# Altium schematic sheet m-2.SchDoc
size 420 x 297 mm
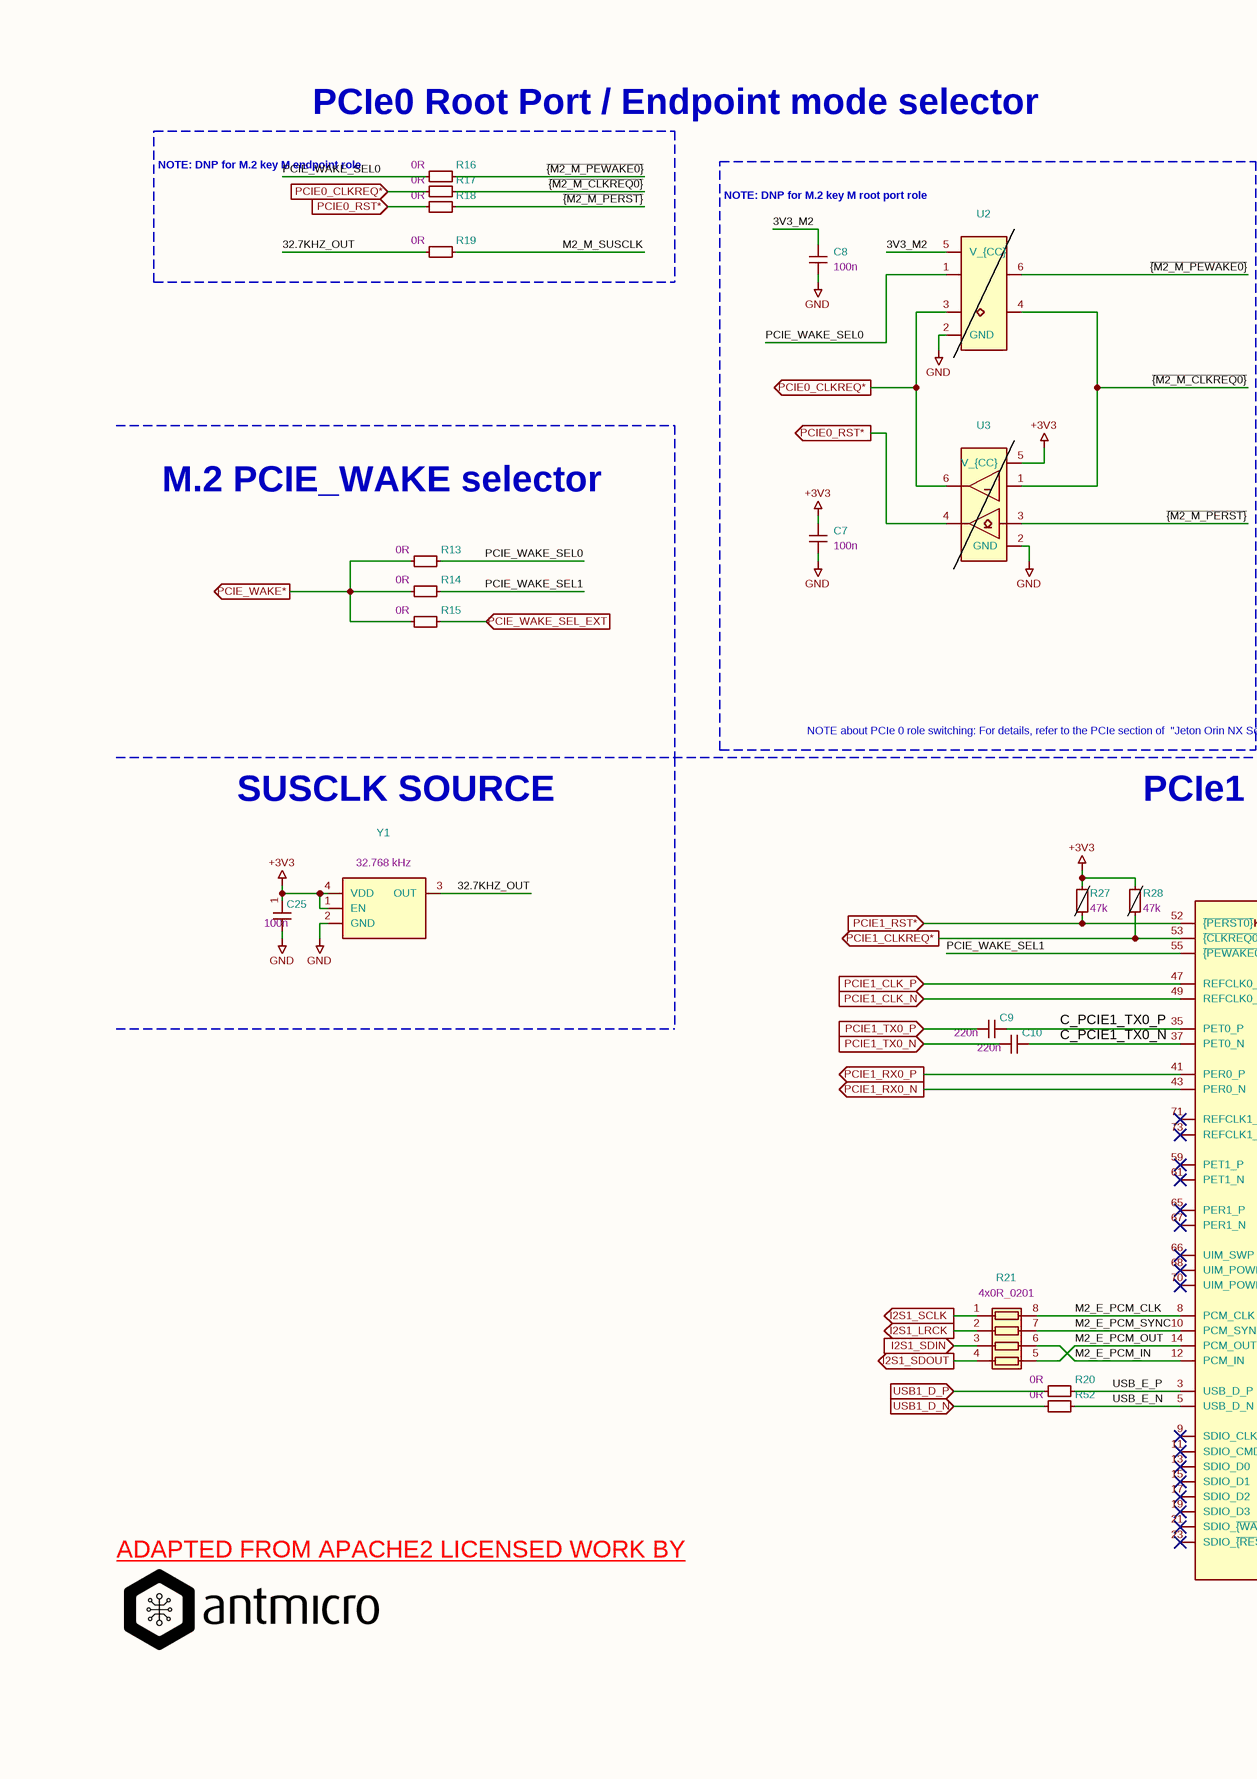
[diagram p0: m-2.SchDoc, left]
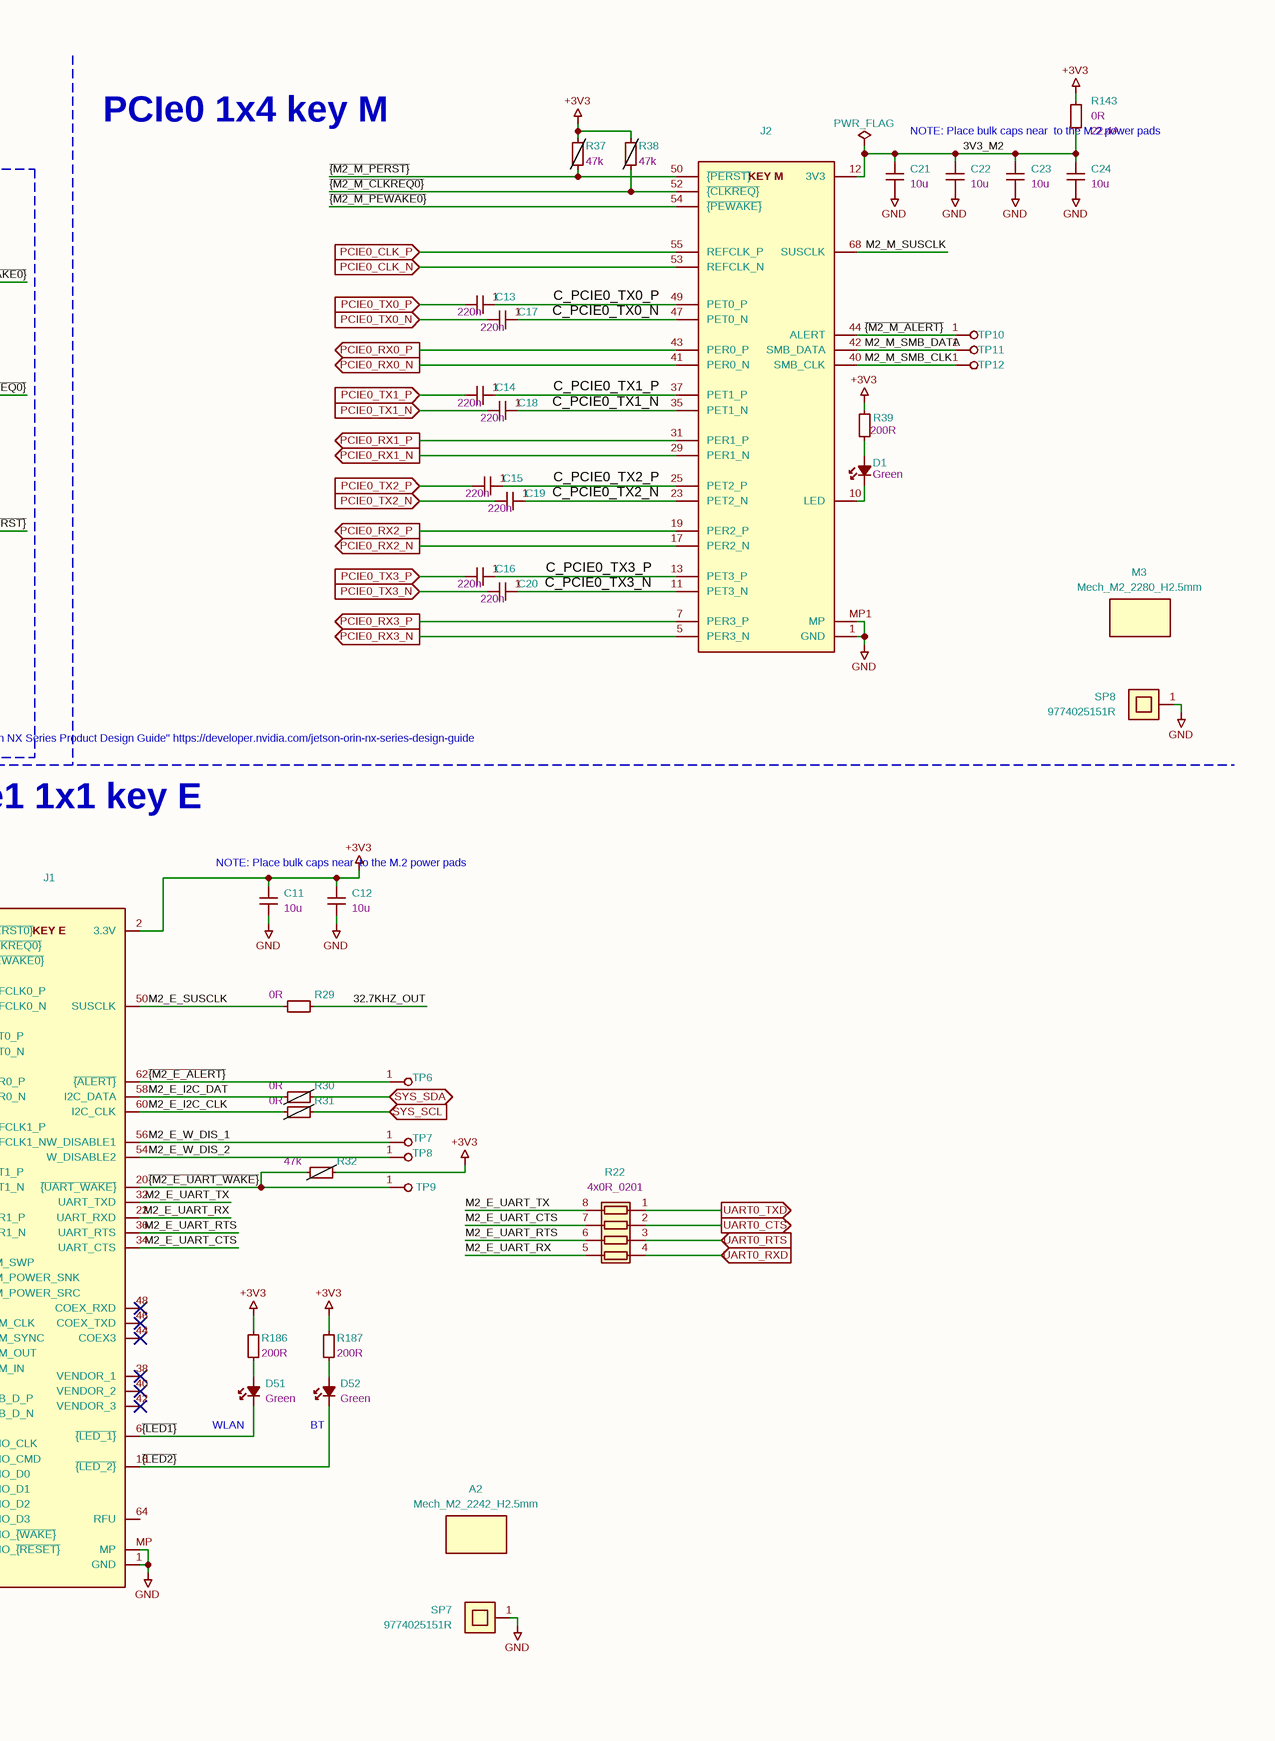
[diagram p1: m-2.SchDoc, right]

## Parts
#FLG02  PWR_FLAG  (graphical)
A2  Mech_M2_2242_H2.5mm  [Mech_M2_2242_H2.5mm]
C7  Val: 100n  [C_0402_1005Metric]  (hidden comment: GRM155R61H104KE14D)
C8  Val: 100n  [C_0402_1005Metric]  (hidden comment: GRM155R61H104KE14D)
C9  Val: 220n  [C_0402_1005Metric]  (hidden comment: CC0402KRX5R6BB224)
C10  Val: 220n  [C_0402_1005Metric]  (hidden comment: CC0402KRX5R6BB224)
C11  Val: 10u  [C_0603_1608Metric]  (hidden comment: GRM188R61A106KE69D)
C12  Val: 10u  [C_0603_1608Metric]  (hidden comment: GRM188R61A106KE69D)
C13  Val: 220n  [C_0402_1005Metric]  (hidden comment: CC0402KRX5R6BB224)
C14  Val: 220n  [C_0402_1005Metric]  (hidden comment: CC0402KRX5R6BB224)
C15  Val: 220n  [C_0402_1005Metric]  (hidden comment: CC0402KRX5R6BB224)
C16  Val: 220n  [C_0402_1005Metric]  (hidden comment: CC0402KRX5R6BB224)
C17  Val: 220n  [C_0402_1005Metric]  (hidden comment: CC0402KRX5R6BB224)
C18  Val: 220n  [C_0402_1005Metric]  (hidden comment: CC0402KRX5R6BB224)
C19  Val: 220n  [C_0402_1005Metric]  (hidden comment: CC0402KRX5R6BB224)
C20  Val: 220n  [C_0402_1005Metric]  (hidden comment: CC0402KRX5R6BB224)
C21  Val: 10u  [C_0603_1608Metric]  (hidden comment: GRM188R61A106KE69D)
C22  Val: 10u  [C_0603_1608Metric]  (hidden comment: GRM188R61A106KE69D)
C23  Val: 10u  [C_0603_1608Metric]  (hidden comment: GRM188R61A106KE69D)
C24  Val: 10u  [C_0603_1608Metric]  (hidden comment: GRM188R61A106KE69D)
C25  Val: 100n  [C_0402_1005Metric]  (hidden comment: GRM155R61H104KE14D)
D1  Color: Green  [LED_0603_1608Metric_G]  (hidden comment: LTST-C190GKT)
D51  Color: Green  [LED_0603_1608Metric_G]  (hidden comment: LTST-C190GKT)
D52  Color: Green  [LED_0603_1608Metric_G]  (hidden comment: LTST-C190GKT)
J1  2199230-6  [Bus_M.2_Socket_Key_E_TE_2199230-6]  (value not drawn)
J2  1-2199230-6  [Bus_M.2_Socket_Key_M_TE_1-2199230-6]  (value not drawn)
M3  Mech_M2_2280_H2.5mm  [Mech_M2_2280_H2.5mm]  (mechanical)
R13  Val: 0R  [R_0402_1005Metric]  (hidden comment: ERJ2GE0R00X)
R14  Val: 0R  [R_0402_1005Metric]  (hidden comment: ERJ2GE0R00X)
R15  Val: 0R  [R_0402_1005Metric]  (hidden comment: ERJ2GE0R00X)
R16  Val: 0R  [R_0402_1005Metric]  (hidden comment: ERJ2GE0R00X)
R17  Val: 0R  [R_0402_1005Metric]  (hidden comment: ERJ2GE0R00X)
R18  Val: 0R  [R_0402_1005Metric]  (hidden comment: ERJ2GE0R00X)
R19  Val: 0R  [R_0402_1005Metric]  (hidden comment: ERJ2GE0R00X)
R20  Val: 0R  [R_0402_1005Metric]  (hidden comment: ERJ2GE0R00X)
R21  Val: 4x0R_0201  [R_Array_4x0201_Panasonic_EXB18V]  (hidden comment: EXB-18VR000X)
R22  Val: 4x0R_0201  [R_Array_4x0201_Panasonic_EXB18V]  (hidden comment: EXB-18VR000X)
R27  Val: 47k  [R_0402_1005Metric]  (hidden comment: CR0402-FX-4702GLF)  (no BOM)
R28  Val: 47k  [R_0402_1005Metric]  (hidden comment: CR0402-FX-4702GLF)  (no BOM)
R29  Val: 0R  [R_0402_1005Metric]  (hidden comment: ERJ2GE0R00X)
R30  Val: 0R  [R_0402_1005Metric]  (hidden comment: ERJ2GE0R00X)  (no BOM)
R31  Val: 0R  [R_0402_1005Metric]  (hidden comment: ERJ2GE0R00X)  (no BOM)
R32  Val: 47k  [R_0402_1005Metric]  (hidden comment: CR0402-FX-4702GLF)  (no BOM)
R37  Val: 47k  [R_0402_1005Metric]  (hidden comment: CR0402-FX-4702GLF)  (no BOM)
R38  Val: 47k  [R_0402_1005Metric]  (hidden comment: CR0402-FX-4702GLF)  (no BOM)
R39  Val: 200R  [R_0402_1005Metric]  (hidden comment: CR0402-FX-2000GLF)
R52  Val: 0R  [R_0402_1005Metric]  (hidden comment: ERJ2GE0R00X)
R143  Val: 0R  Max. Curr.: 22.4A  [R_0603_1608Metric]  (hidden comment: PMR03EZPJ000)
R186  Val: 200R  [R_0402_1005Metric]  (hidden comment: CR0402-FX-2000GLF)
R187  Val: 200R  [R_0402_1005Metric]  (hidden comment: CR0402-FX-2000GLF)
SP7  9774025151R  [Spacer_Drill3.7mm_H2.5mm_9774025151R]
SP8  9774025151R  [Spacer_Drill3.7mm_H2.5mm_9774025151R]
TP6  TP_0.75mm_SMD  [TP_SMD_0.75mm]  (value not drawn)  (no BOM)
TP7  TP_0.75mm_SMD  [TP_SMD_0.75mm]  (value not drawn)  (no BOM)
TP8  TP_0.75mm_SMD  [TP_SMD_0.75mm]  (value not drawn)  (no BOM)
TP9  TP_0.75mm_SMD  [TP_SMD_0.75mm]  (value not drawn)  (no BOM)
TP10  TP_0.75mm_SMD  [TP_SMD_0.75mm]  (value not drawn)  (no BOM)
TP11  TP_0.75mm_SMD  [TP_SMD_0.75mm]  (value not drawn)  (no BOM)
TP12  TP_0.75mm_SMD  [TP_SMD_0.75mm]  (value not drawn)  (no BOM)
U2  74LVC2G07GV,125  [SC-74-6_1.5x2.9mm_P0.95mm]  (value not drawn)  (no BOM)
U3  74LVC2G07GV,125  [SC-74-6_1.5x2.9mm_P0.95mm]  (value not drawn)  (no BOM)
Y1  Val: 32.768 kHz  [Oscillator_SMD_ECS_2520MV_2.5x2mm]  (hidden comment: ECS-327MVATX-2-CN-TR3)

## Blocks framed on the sheet
PCIe0 Root Port / Endpoint mode selector: R16-R19
NOTE: / DNP for M.2 key M / root port role: C7 C8 U2 U3

## Ports
I2S1_LRCK (out), I2S1_SCLK (out), I2S1_SDIN (in), I2S1_SDOUT (out), PCIE0_CLK_N (in), PCIE0_CLK_P (in), PCIE0_CLKREQ* (in), PCIE0_CLKREQ* (out), PCIE0_RST* (in), PCIE0_RST* (out), PCIE0_RX0_N (out), PCIE0_RX0_P (out), PCIE0_RX1_N (out), PCIE0_RX1_P (out), PCIE0_RX2_N (out), PCIE0_RX2_P (out), PCIE0_RX3_N (out), PCIE0_RX3_P (out), PCIE0_TX0_N (in), PCIE0_TX0_P (in), PCIE0_TX1_N (in), PCIE0_TX1_P (in), PCIE0_TX2_N (in), PCIE0_TX2_P (in), PCIE0_TX3_N (in), PCIE0_TX3_P (in), PCIE1_CLK_N (in), PCIE1_CLK_P (in), PCIE1_CLKREQ* (out), PCIE1_RST* (in), PCIE1_RX0_N (out), PCIE1_RX0_P (out), PCIE1_TX0_N (in), PCIE1_TX0_P (in), PCIE_WAKE* (out), PCIE_WAKE_SEL_EXT (in), SYS_SCL (in), SYS_SDA (bidir), UART0_CTS (out), UART0_RTS (in), UART0_RXD (in), UART0_TXD (out), USB1_D_N (in), USB1_D_P (in)

## Nets
+3V3: C7.1 C11.1 C12.1 C25.1 J1.2(3.3V) R27.1 R28.1 R32.2 R37.1 R38.1 R39.2 R143.2 R186.2 R187.2 U3.5(V_{CC}) Y1.1(EN) Y1.4(VDD)
GND: C7.2 C8.2 C11.2 C12.2 C21.2 C22.2 C23.2 C24.2 C25.2 J1.1(GND) J1.MP J2.1(GND) J2.MP1(MP) SP7.1 SP8.1 U2.2(GND) U3.2(GND) Y1.2(GND)
3V3_M2: #FLG02.1(pwr) C8.1 C21.1 C22.1 C23.1 C24.1 J2.12(3V3) R143.1 U2.5(V_{CC})
32.7KHZ_OUT: R19.1 R29.2 Y1.3(OUT)
C_PCIE0_TX0_N: C17.1 J2.47(PET0_N)
C_PCIE0_TX0_P: C13.1 J2.49(PET0_P)
C_PCIE0_TX1_N: C18.1 J2.35(PET1_N)
C_PCIE0_TX1_P: C14.1 J2.37(PET1_P)
C_PCIE0_TX2_N: C19.1 J2.23(PET2_N)
C_PCIE0_TX2_P: C15.1 J2.25(PET2_P)
C_PCIE0_TX3_N: C20.1 J2.11(PET3_N)
C_PCIE0_TX3_P: C16.1 J2.13(PET3_P)
C_PCIE1_TX0_N: C10.2 J1.37(PET0_N)
C_PCIE1_TX0_P: C9.2 J1.35(PET0_P)
I2S1_LRCK: R21.2(R2.1) ; port I2S1_LRCK
I2S1_SCLK: R21.1(R1.1) ; port I2S1_SCLK
I2S1_SDIN: R21.3(R3.1) ; port I2S1_SDIN
I2S1_SDOUT: R21.4(R4.1) ; port I2S1_SDOUT
M2_E_I2C_CLK: J1.60(I2C_CLK) R31.1
M2_E_I2C_DAT: J1.58(I2C_DATA) R30.1
M2_E_PCM_CLK: J1.8(PCM_CLK) R21.8(R1.2)
M2_E_PCM_IN: J1.12(PCM_IN) R21.6(R3.2)
M2_E_PCM_OUT: J1.14(PCM_OUT) R21.5(R4.2)
M2_E_PCM_SYNC: J1.10(PCM_SYNC) R21.7(R2.2)
M2_E_SUSCLK: J1.50(SUSCLK) R29.1
M2_E_UART_CTS: J1.34(UART_CTS) R22.7(R2.2)
M2_E_UART_RTS: J1.36(UART_RTS) R22.6(R3.2)
M2_E_UART_RX: J1.22(UART_RXD) R22.5(R4.2)
M2_E_UART_TX: J1.32(UART_TXD) R22.8(R1.2)
M2_E_W_DIS_1: J1.56(W_DISABLE1) TP7.1
M2_E_W_DIS_2: J1.54(W_DISABLE2) TP8.1
M2_M_SMB_CLK: J2.40(SMB_CLK) TP12.1
M2_M_SMB_DATA: J2.42(SMB_DATA) TP11.1
M2_M_SUSCLK: J2.68(SUSCLK) R19.2
PCIE0_CLK_N: J2.53(REFCLK_N) ; port PCIE0_CLK_N
PCIE0_CLK_P: J2.55(REFCLK_P) ; port PCIE0_CLK_P
PCIE0_CLKREQ*: R17.1 U2.3 U3.6 ; port PCIE0_CLKREQ*
PCIE0_RST*: R18.1 U3.4 ; port PCIE0_RST*
PCIE0_RX0_N: J2.41(PER0_N) ; port PCIE0_RX0_N
PCIE0_RX0_P: J2.43(PER0_P) ; port PCIE0_RX0_P
PCIE0_RX1_N: J2.29(PER1_N) ; port PCIE0_RX1_N
PCIE0_RX1_P: J2.31(PER1_P) ; port PCIE0_RX1_P
PCIE0_RX2_N: J2.17(PER2_N) ; port PCIE0_RX2_N
PCIE0_RX2_P: J2.19(PER2_P) ; port PCIE0_RX2_P
PCIE0_RX3_N: J2.5(PER3_N) ; port PCIE0_RX3_N
PCIE0_RX3_P: J2.7(PER3_P) ; port PCIE0_RX3_P
PCIE0_TX0_N: C17.2 ; port PCIE0_TX0_N
PCIE0_TX0_P: C13.2 ; port PCIE0_TX0_P
PCIE0_TX1_N: C18.2 ; port PCIE0_TX1_N
PCIE0_TX1_P: C14.2 ; port PCIE0_TX1_P
PCIE0_TX2_N: C19.2 ; port PCIE0_TX2_N
PCIE0_TX2_P: C15.2 ; port PCIE0_TX2_P
PCIE0_TX3_N: C20.2 ; port PCIE0_TX3_N
PCIE0_TX3_P: C16.2 ; port PCIE0_TX3_P
PCIE1_CLK_N: J1.49(REFCLK0_N) ; port PCIE1_CLK_N
PCIE1_CLK_P: J1.47(REFCLK0_P) ; port PCIE1_CLK_P
PCIE1_CLKREQ*: J1.53(~{{CLKREQ0}}) R28.2 ; port PCIE1_CLKREQ*
PCIE1_RST*: J1.52(~{{PERST0}}) R27.2 ; port PCIE1_RST*
PCIE1_RX0_N: J1.43(PER0_N) ; port PCIE1_RX0_N
PCIE1_RX0_P: J1.41(PER0_P) ; port PCIE1_RX0_P
PCIE1_TX0_N: C10.1 ; port PCIE1_TX0_N
PCIE1_TX0_P: C9.1 ; port PCIE1_TX0_P
PCIE_WAKE*: R13.1 R14.1 R15.1 ; port PCIE_WAKE*
PCIE_WAKE_SEL0: R13.2 R16.1 U2.1
PCIE_WAKE_SEL1: J1.55(~{{PEWAKE0}}) R14.2
PCIE_WAKE_SEL_EXT: R15.2 ; port PCIE_WAKE_SEL_EXT
SYS_SCL: R31.2 ; port SYS_SCL
SYS_SDA: R30.2 ; port SYS_SDA
UART0_CTS: R22.2(R2.1) ; port UART0_CTS
UART0_RTS: R22.3(R3.1) ; port UART0_RTS
UART0_RXD: R22.4(R4.1) ; port UART0_RXD
UART0_TXD: R22.1(R1.1) ; port UART0_TXD
USB1_D_N: R52.1 ; port USB1_D_N
USB1_D_P: R20.1 ; port USB1_D_P
USB_E_N: J1.5(USB_D_N) R52.2
USB_E_P: J1.3(USB_D_P) R20.2
~{{LED1}}: D51.1(C) J1.6(~{{LED_1}})
~{{LED2}}: D52.1(C) J1.16(~{{LED_2}})
~{{M2_E_ALERT}}: J1.62(~{{ALERT}}) TP6.1
~{{M2_E_UART_WAKE}}: J1.20(~{{UART_WAKE}}) R32.1 TP9.1
~{{M2_M_ALERT}}: J2.44(ALERT) TP10.1
~{{M2_M_CLKREQ0}}: J2.52(~{{CLKREQ}}) R17.2 R38.2 U2.4 U3.1
~{{M2_M_PERST}}: J2.50(~{{PERST}}) R18.2 R37.2 U3.3
~{{M2_M_PEWAKE0}}: J2.54(~{{PEWAKE}}) R16.2 U2.6
NetD1_1: D1.1(C) J2.10(LED)
NetD1_2: D1.2(A) R39.1
NetD51_2: D51.2(A) R186.1
NetD52_2: D52.2(A) R187.1

Not connected (* = marked no-connect by the designer): J1 4(3.3V) 7(GND) 9(SDIO_CLK)* 11(SDIO_CMD)* 13(SDIO_D0)* 15(SDIO_D1)* 17(SDIO_D2)* 18(GND) 19(SDIO_D3)* 21(SDIO_~{{WAKE}})* 23(SDIO_~{{RESET}})* 33(GND) 38(VENDOR_1)* 39(GND) 40(VENDOR_2)* 42(VENDOR_3)* 44(COEX3)* 45(GND) 46(COEX_TXD)* 48(COEX_RXD)* 51(GND) 57(GND) 59(PET1_P)* 61(PET1_N)* 63(GND) 64(RFU) 65(PER1_P)* 66(UIM_SWP)* 67(PER1_N)* 68(UIM_POWER_SNK)* 69(GND) 70(UIM_POWER_SRC)* 71(REFCLK1_P)* 72(3.3V) 73(REFCLK1_N)* 74(3.3V) 75(GND); J2 2(3V3) 3(GND) 4(3V3) 6(NC) 8(NC) 9(GND) 14(3V3) 15(GND) 16(3V3) 18(3V3) 20(NC) 21(GND) 22(NC) 24(NC) 26(NC) 27(GND) 28(NC) 30(NC) 32(NC) 33(GND) 34(NC) 36(NC) 38(NC) 39(GND) 45(GND) 46(NC) 48(NC) 51(GND) 56(NC) 57(GND) 58(NC) 67(NC) 69(NC) 70(3V3) 71(GND) 72(3V3) 73(GND) 74(3V3) 75(GND) MP2(MP)

## Notes on the sheet
- NOTE:
  DNP for M.2 key M
  endpoint role
- PCIe0 1x4 key M
- (near R143) NOTE:
  Place bulk caps near
  to the M.2 power pads
- M.2 PCIE_WAKE selector
- NOTE about PCIe 0 role switching:
  For details, refer to the PCIe section of
  "Jeton Orin NX Series Product Design Guide"
  https://developer.nvidia.com/jetson-orin-nx-series-design-guide
- SUSCLK SOURCE
- PCIe1 1x1 key E
- NOTE:
  Place bulk caps near
  to the M.2 power pads
- (near D51) WLAN
- (near D52) BT
- ADAPTED FROM APACHE2 LICENSED WORK BY <https://github.com/antmicro/jetson-orin-baseboard>
- 1
- 2
- 3
- 4
- 5
- 6
- 7
- 8
- A
- B
- C
- D
- E
- www.antmicro.com <http://www.antmicro.com>
- Title: Jetson Orin Baseboard
- File: m-2.kicad_sch
- Sheet: /
- Antmicro Ltd
- F
- KiCad E.D.A.  kicad (5.1.4)-1
- Size: A3
- Date: 2025-01-15
- Rev: 1.3.0
- Id: 1/1
- (in symbol Bus_M.2_1-2199230-6) KEY M
- (in symbol Bus_M.2_2199230-6) KEY E

## Library data of the parts
A2 = Mech_M2_2242_H2.5mm: License: Apache-2.0; Author: Antmicro; OldValue: Mech_M2_2242_H2.5mm; Value: Mech_M2_2242_H2.5mm; Footprint: antmicro-footprints:Mech_M2_2242_H2.5mm
C7 C8 C25 = C_100n_0402: Manufacturer 1: Murata; License: Apache-2.0; Voltage: 50V; Dielectric: X5R; Author: Antmicro; OldValue: C_100n_0402; Manufacturer Part Number 1: GRM155R61H104KE14D; Value: GRM155R61H104KE14D; Footprint: antmicro-footprints:C_0402_1005Metric
C9 C10 C13-C20 = C_220n_0402: Manufacturer 1: YAGEO; License: Apache-2.0; Author: Antmicro; OldValue: C_220n_0402; Manufacturer Part Number 1: CC0402KRX5R6BB224; Value: CC0402KRX5R6BB224; Footprint: antmicro-footprints:C_0402_1005Metric
C11 C12 C21-C24 = C_10u_0603: Manufacturer 1: Murata; License: Apache-2.0; Dielectric: template_dielectric; Author: Antmicro; OldValue: C_10u_0603; Manufacturer Part Number 1: GRM188R61A106KE69D; Value: GRM188R61A106KE69D; Footprint: antmicro-footprints:C_0603_1608Metric
D1 D51 D52 = LED_G_0603_LTST-C190GKT: Manufacturer 1: Lite-On; License: Apache-2.0; Author: Antmicro; OldValue: LED_G_0603_LTST-C190GKT; Manufacturer Part Number 1: LTST-C190GKT; Value: LTST-C190GKT; Footprint: antmicro-footprints:LED_0603_1608Metric_G
J1 = Bus_M.2_2199230-6: Manufacturer 1: TE Connectivity; License: Apache-2.0; Author: Antmicro; OldValue: Bus_M.2_2199230-6; Manufacturer Part Number 1: 2199230-6; Value: 2199230-6; Footprint: antmicro-footprints:Bus_M.2_Socket_Key_E_TE_2199230-6
J2 = Bus_M.2_1-2199230-6: Manufacturer 1: TE Connectivity; License: Apache-2.0; Author: Antmicro; OldValue: Bus_M.2_1-2199230-6; Manufacturer Part Number 1: 1-2199230-6; Value: 1-2199230-6; Footprint: antmicro-footprints:Bus_M.2_Socket_Key_M_TE_1-2199230-6
M3 = Mech_M2_2280_H2.5mm: License: Apache-2.0; Author: Antmicro; OldValue: Mech_M2_2280_H2.5mm; Value: Mech_M2_2280_H2.5mm; Footprint: antmicro-footprints:Mech_M2_2280_H2.5mm
R13-R20 R29-R31 R52 = R_0R_0402: Manufacturer 1: Panasonic; License: Apache-2.0; Tolerance: ~; Current: 1A; Author: Antmicro; OldValue: R_0R_0402; Manufacturer Part Number 1: ERJ2GE0R00X; Value: ERJ2GE0R00X; Footprint: antmicro-footprints:R_0402_1005Metric
R21 R22 = R_4x0R_0201_array: Manufacturer 1: Panasonic; License: Apache-2.0; Author: Antmicro; OldValue: R_4x0R_0201_array; Manufacturer Part Number 1: EXB-18VR000X; Value: EXB-18VR000X; Footprint: antmicro-footprints:R_Array_4x0201_Panasonic_EXB18V
R27 R28 R32 R37 R38 = R_47k_0402: Manufacturer 1: Bourns; License: Apache-2.0; Tolerance: 1%; Author: Antmicro; OldValue: R_47k_0402; Manufacturer Part Number 1: CR0402-FX-4702GLF; Value: CR0402-FX-4702GLF; Footprint: antmicro-footprints:R_0402_1005Metric
R39 R186 R187 = R_200R_0402: Manufacturer 1: Bourns; License: Apache-2.0; Tolerance: 1%; Author: Antmicro; OldValue: R_200R_0402; Manufacturer Part Number 1: CR0402-FX-2000GLF; Value: CR0402-FX-2000GLF; Footprint: antmicro-footprints:R_0402_1005Metric
R143 = R_0R_22.4A_0603: Manufacturer 1: ROHM Semiconductor; License: Apache-2.0; Tolerance: template_tolerance; Author: Antmicro; OldValue: R_0R_22.4A_0603; Manufacturer Part Number 1: PMR03EZPJ000; Value: PMR03EZPJ000; Footprint: antmicro-footprints:R_0603_1608Metric
SP7 = Spacer_Drill3.7mm_H2.5mm_9774025151R: Manufacturer 1: Würth Elektronik; License: Apache-2.0; Author: Antmicro; OldValue: Spacer_Drill3.7mm_H2.5mm_9774025151R; Manufacturer Part Number 1: 9774025151R; Value: 9774025151R; Footprint: antmicro-footprints:Spacer_Drill3.7mm_H2.5mm_9774025151R
SP8 = Spacer_Drill3.7mm_H2.5mm_9774025151R_1: Manufacturer 1: Würth Elektronik; License: Apache-2.0; Author: Antmicro; OldValue: Spacer_Drill3.7mm_H2.5mm_9774025151R; Manufacturer Part Number 1: 9774025151R; Value: 9774025151R; Footprint: antmicro-footprints:Spacer_Drill3.7mm_H2.5mm_9774025151R
TP6-TP9 = TP_0.75mm_SMD: License: Apache-2.0; Author: Antmicro; OldValue: TP_0.75mm_SMD; Value: TP_0.75mm_SMD; Footprint: antmicro-footprints:TP_SMD_0.75mm
TP10 = TP_0.75mm_SMD_1: License: Apache-2.0; Author: Antmicro; OldValue: TP_0.75mm_SMD; Value: TP_0.75mm_SMD; Footprint: antmicro-footprints:TP_SMD_0.75mm
TP11 = TP_0.75mm_SMD_2: License: Apache-2.0; Author: Antmicro; OldValue: TP_0.75mm_SMD; Value: TP_0.75mm_SMD; Footprint: antmicro-footprints:TP_SMD_0.75mm
TP12 = TP_0.75mm_SMD_3: License: Apache-2.0; Author: Antmicro; OldValue: TP_0.75mm_SMD; Value: TP_0.75mm_SMD; Footprint: antmicro-footprints:TP_SMD_0.75mm
U2 U3 = 74LVC2G07_SOT457: Manufacturer 1: Nexperia; License: Apache-2.0; Author: Antmicro; OldValue: 74LVC2G07_SOT457; Manufacturer Part Number 1: 74LVC2G07GV,125; Value: 74LVC2G07GV,125; Footprint: antmicro-footprints:SC-74-6_1.5x2.9mm_P0.95mm
Y1 = Oscillator_32.768kHz_ECS_2520MV: Manufacturer 1: ECS Inc. International; License: Apache-2.0; Author: Antmicro; OldValue: Oscillator_32.768kHz_ECS_2520MV; Manufacturer Part Number 1: ECS-327MVATX-2-CN-TR3; Value: ECS-327MVATX-2-CN-TR3; Footprint: antmicro-footprints:Oscillator_SMD_ECS_2520MV_2.5x2mm
#FLG02 = PWR_FLAG: Value: PWR_FLAG